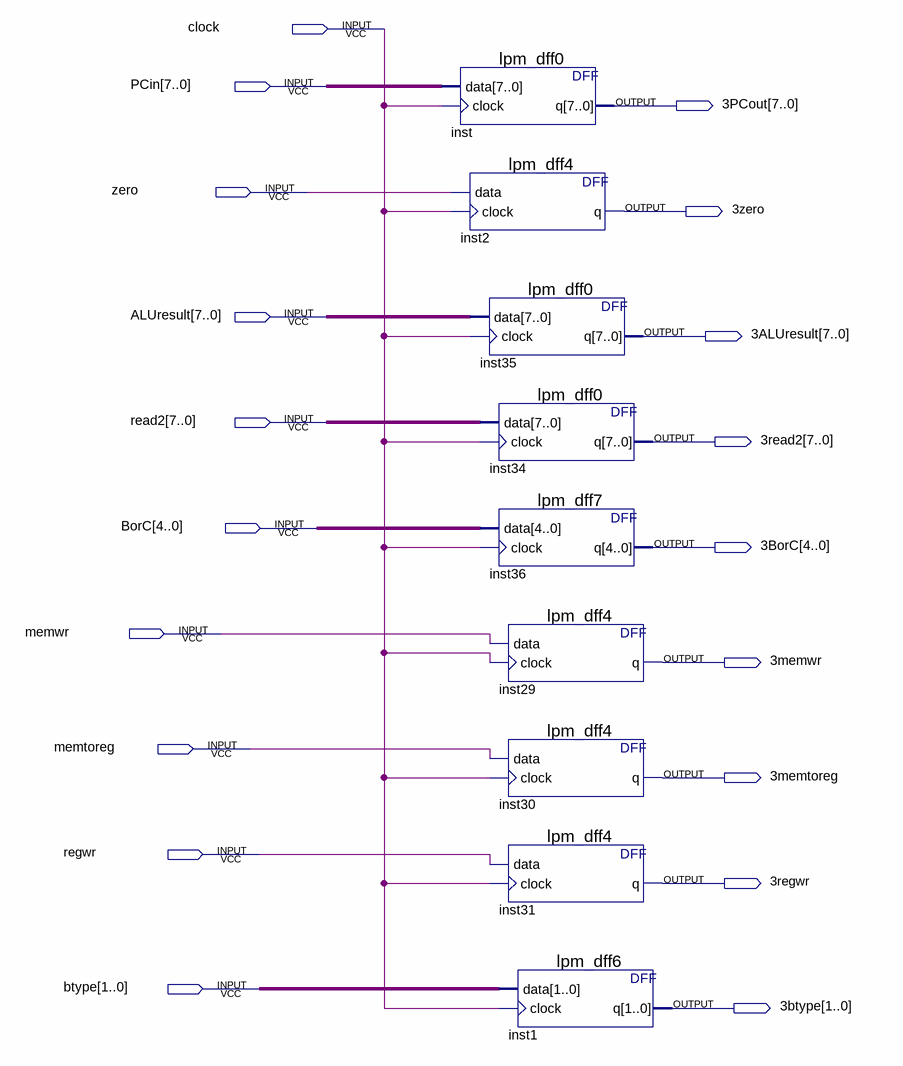
[diagram p0: schematic sheet]
// Quartus schematic Ex_Mem.bdf as structural Verilog: 9 symbols, 19 pins
module Ex_Mem (
  input  clock,
  input  [7:0] PCin,
  input  zero,
  input  [7:0] ALUresult,
  input  [7:0] read2,
  input  [4:0] BorC,
  input  memwr,
  input  memtoreg,
  input  regwr,
  input  [1:0] btype,
  output [7:0] \3PCout ,
  output \3zero ,
  output [7:0] \3ALUresult ,
  output [7:0] \3read2 ,
  output [4:0] \3BorC ,
  output \3memwr ,
  output \3memtoreg ,
  output \3regwr ,
  output [1:0] \3btype 
);

  lpm_dff0 inst (.data(PCin), .clock(clock), .q(\3PCout ));
  lpm_dff4 inst2 (.data(zero), .clock(clock), .q(\3zero ));
  lpm_dff0 inst35 (.data(ALUresult), .clock(clock), .q(\3ALUresult ));
  lpm_dff0 inst34 (.data(read2), .clock(clock), .q(\3read2 ));
  lpm_dff7 inst36 (.data(BorC), .clock(clock), .q(\3BorC ));
  lpm_dff4 inst29 (.data(memwr), .clock(clock), .q(\3memwr ));
  lpm_dff4 inst30 (.data(memtoreg), .clock(clock), .q(\3memtoreg ));
  lpm_dff4 inst31 (.data(regwr), .clock(clock), .q(\3regwr ));
  lpm_dff6 inst1 (.data(btype), .clock(clock), .q(\3btype ));
endmodule
